# EasyEDA Pro project project.hail.fally.epro

# Schematic Schematic1
Board Name: Board1; Create Date: 2026-05-29; Page Name: P1; Project Name: Project Hail Fallyy; Schematic Name: Schematic1; Update Date: 2026-05-31; Company: EasyEDA.com; Page Size: A4; Version: V1.0
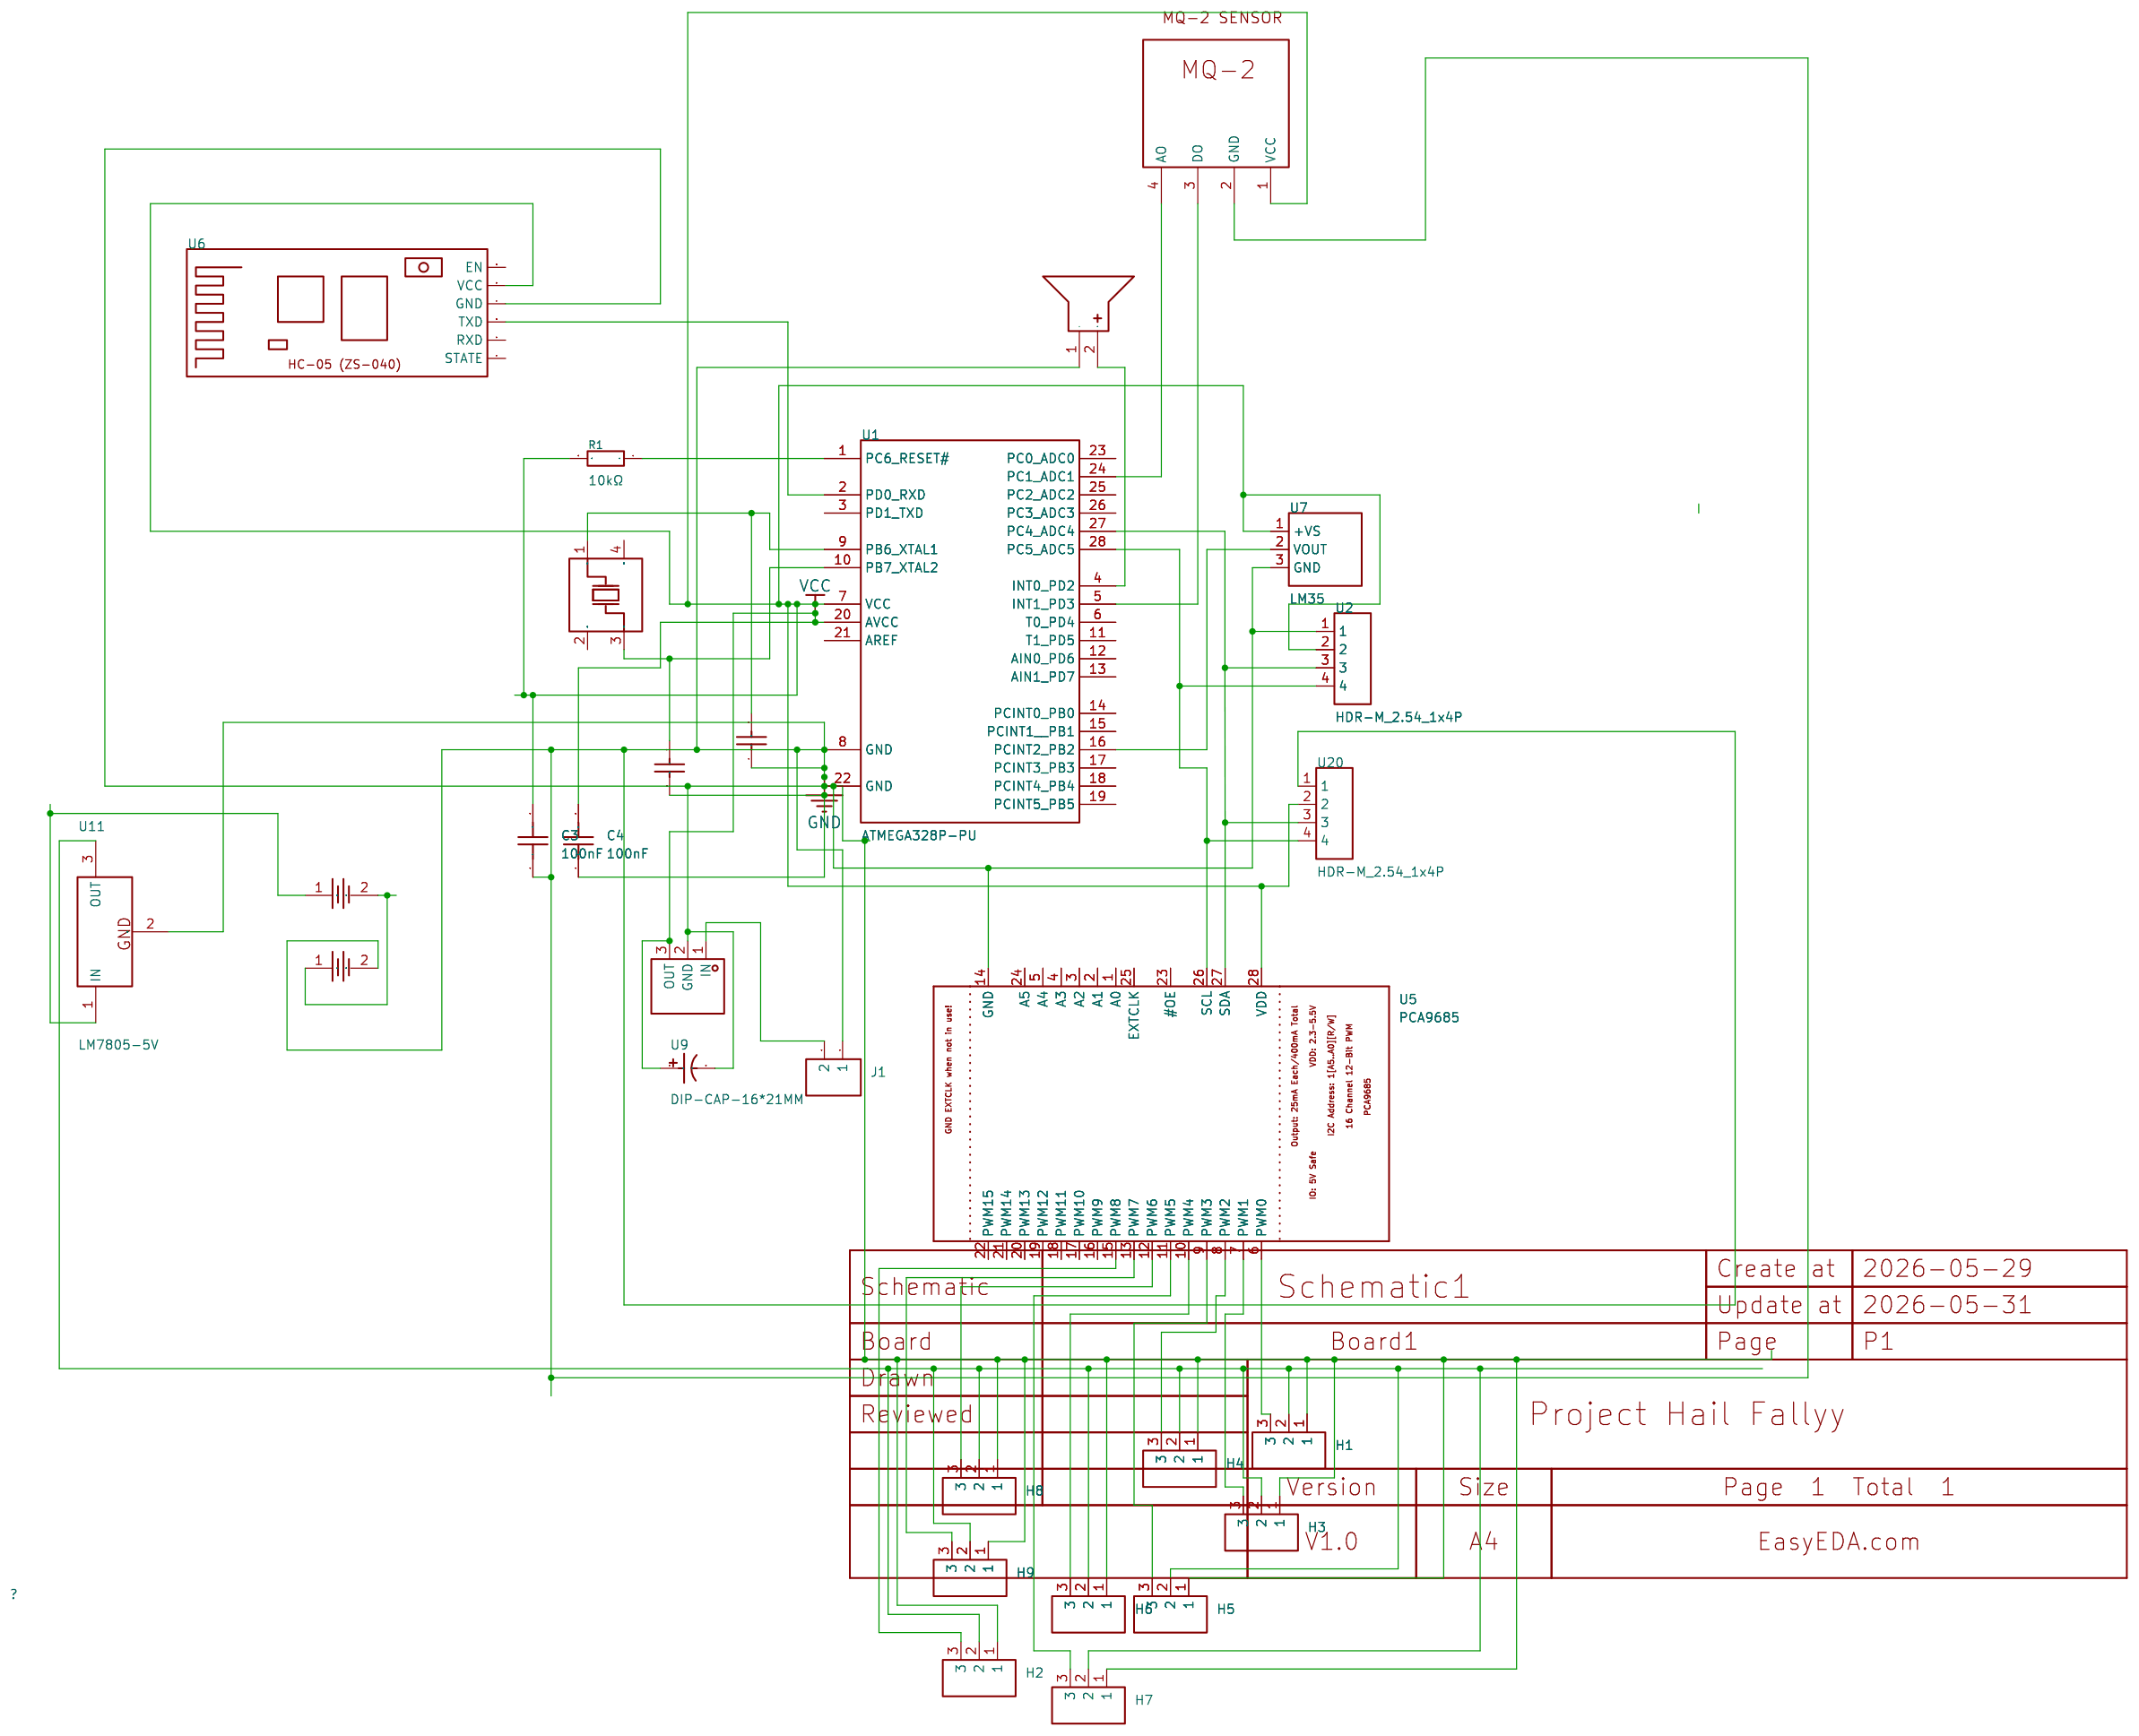
[diagram p0: schematic sheet]

## Parts
BT1  BH-18650-A5BJ001  [BAT-TH_18650-A5BJ001]
BT2  BH-18650-A5BJ001  [BAT-TH_18650-A5BJ001]
BUZZER1  buzzer  [BUZ-TH_BD12.0-P6.00-D0.9-RD]
C1  22pF  [C0805]
C2  22pF  [C0805]
C3  100nF  [C0402]
C4  100nF  [C0402]
H1  -  [HDR-TH_3P-P2.54-V-M]
H2  -  [HDR-TH_3P-P2.54-V-M]
H3  -  [HDR-TH_3P-P2.54-V-M]
H4  -  [HDR-TH_3P-P2.54-V-M]
H5  -  [HDR-TH_3P-P2.54-V-M]
H6  -  [HDR-TH_3P-P2.54-V-M]
H7  -  [HDR-TH_3P-P2.54-V-M]
H8  -  [HDR-TH_3P-P2.54-V-M]
H9  -  [HDR-TH_3P-P2.54-V-M]
J1  Bettery Connector  [HDR-M-2.54_1X2]
R1  10kΩ  [R1206]
S1  Sensor_MQ-2_module_vertical_AIH  [SENSOR_MQ-2_MODULE_VERTICAL_AIH]
U1  ATMEGA328P-PU  [DIP-28_L34.6-W7.3-P2.54-LS10.2-BL]
U2  HDR-M_2.54_1x4P  [HDR-TH_HDR-M_2.54_1X4P]
U3  LM7805  [TO-220-3_L10.0-W4.5-P2.54-L]
U5  PCA9685  [TSSOP28]
U6  HC05-Bluetooth-Module_AK  [hc05-bluetooth-module_ak]
U7  LM35  [TO-92-3_L4.8-W3.7-P1.27-L]
U9  470uF  [CAP-TH_BD13.0-P5.00-D0.6-FD]
U11  LM7805-5V  [TO-252-2_L6.6-W6.1-P4.58-LS9.9-TL]
U20  HDR-M_2.54_1x4P  [HDR-TH_HDR-M_2.54_1X4P]
X1  16MHz  [CRYSTAL-SMD_4P-L3.2-W2.5-BL]

## Library data of the parts
BT1 BT2 = BH-18650-A5BJ001: Connector Type:Battery box Battery Type:- Contact Plating:Nickel Operating Temperature Range:-25℃~+85℃ Operating Temperature Range:-25℃~+85℃; LCSC Part Name: 电池盒; Supplier Part: C5383220; Manufacturer: MYOUNG(美阳); Supplier Footprint: 插件; JLCPCB Part Class: Extended Part; Datasheet: https://atta.szlcsc.com/upload/public/pdf/source/20230321/F45C04DF2D4E00D187312CBE97BD9F67.pdf; Supplier: LCSC; Connector Type: Battery box; Contact Plating: Nickel; Operating Temperature Range: -25℃~+85℃
BUZZER1 = BUZZER: Supplier Part: C9900014030; JLCPCB Part Class: Extended Part; Supplier: LCSC
C1 C2 = CL21C220JBANNNC: Capacitance:22pF Tolerance:±5% Tolerance:±5% Voltage Rating:50V Temperature Coefficient:C0G; LCSC Part Name: 22pF ±5% 50V; Supplier Part: C1804; Manufacturer: SAMSUNG(三星); Supplier Footprint: 0805; JLCPCB Part Class: Basic Part; Datasheet: https://item.szlcsc.com/datasheet/CL21C220JBANNNC/2156.html; Supplier: LCSC; Tolerance: ±5%; Voltage Rating: 50V; Temperature Coefficient: C0G
C3 C4 = CL05B104KB54PNC: Capacitance:100nF Tolerance:±10% Tolerance:±10% Voltage Rating:50V Temperature Coefficient:X7R; LCSC Part Name: 100nF ±10% 50V; Supplier Part: C307331; Manufacturer: SAMSUNG(三星); Supplier Footprint: 0402; JLCPCB Part Class: Basic Part; Datasheet: https://item.szlcsc.com/datasheet/CL05B104KB54PNC/291005.html; Supplier: LCSC; Tolerance: ±10%; Voltage Rating: 50V; Temperature Coefficient: X7R
H1-H9 = HDR-M_2.54_1x3P: Supplier Footprint: Through
J1 = Bettery Connector
R1 = 1206W4F1002T5E: Type:Thick Film Resistor Resistance:10kΩ Tolerance:±1% Tolerance:±1% Power(Watts):250mW Voltage-Supply(Max):200V Temperature Coefficient:±100ppm/℃ Temperature Coefficient:±100ppm/℃ Operating Temperature:-55℃~+155℃ Operating Temperature:-55℃~+155℃; LCSC Part Name: 10kΩ ±1% 250mW 厚膜电阻; Supplier Part: C17902; Manufacturer: UNI-ROYAL(厚声); Supplier Footprint: 1206; JLCPCB Part Class: Basic Part; Datasheet: https://item.szlcsc.com/datasheet/1206W4F1002T5E/18590.html; Supplier: LCSC; Type: Thick Film Resistor; Tolerance: ±1%; Power(Watts): 250mW; Voltage-Supply(Max): 200V; Temperature Coefficient: ±100ppm/℃; Operating Temperature: -55℃~+155℃
S1 = MQ-2
U1 = ATMEGA328P-PU: CPU Core:AVR CPU Maximum Speed:20MHz Program Storage Size:32KB Program Memory Type:FLASH Number of I/O:23 ADC (Bit):10bit Voltage - Supply:1.8V~5.5V Voltage - Supply:1.8V~5.5V Applications:-; LCSC Part Name: MSL=1 基于AVR增强型RISC架构的低功耗CMOS 8位微控制器; Supplier Part: C33901; Manufacturer: MICROCHIP(美国微芯); Supplier Footprint: DIP-28-300mil; JLCPCB Part Class: Extended Part; Datasheet: https://item.szlcsc.com/datasheet/ATMEGA328P-PU/34869.html; Supplier: LCSC; CPU Core: AVR; CPU Maximum Speed: 20MHz; Program Storage Size: 32KB; Program Memory Type: FLASH; Number of I/O: 23; ADC (Bit): 10bit; Voltage - Supply: 1.8V~5.5V
U2 U20 = HDR-M_2.54_1x4P_C9900236824: Supplier Part: C9900236824; Supplier Footprint: HDR-TH_4P-P2.54-V-M; JLCPCB Part Class: Extended Part; Supplier: LCSC
U3 = LM7805_C845394: Output Type:Fixed Voltage - Supply:35V Output Voltage:5V Output Voltage:5V Output Current:- Power Supply Rejection Ratio (PSRR):73dB@(120Hz) Voltage Dropout:2V@(1A) standby current:5mA Noise:42uV Operating Temperature:0℃~+150℃@(Tj) Operating Temperature:0; Supplier Part: C845394; Manufacturer: TF(拓锋); Supplier Footprint: TO-220; JLCPCB Part Class: Extended Part; Datasheet: https://item.szlcsc.com/datasheet/LM7805/905247.html; Supplier: LCSC; Output Type: Fixed; Voltage - Supply: 35V; Output Voltage: 5V; Power Supply Rejection Ratio (PSRR): 73dB@(120Hz); Voltage Dropout: 2V@(1A); standby current: 5mA; Noise: 42uV; Operating Temperature: 0℃~+150℃@(Tj); Output Configuration: Positive; Number of Outputs: 1
U5 = PCA9685
U6 = HC05-Bluetooth-Module_AK: Modulo bluetooth
U7 = LM35: Detection Temperature Range:-40℃~+125℃ Detection Temperature Range:-40℃~+125℃ Tolerance:±0.5℃ Tolerance:±0.5℃ Voltage - Supply:4V~30V Voltage - Supply:4V~30V Standby Current:- Interface:- Temperature Conversion Time:- Temperature Resolution:- Operating Te; LCSC Part Name: 高精度摄氏度温度传感器; Supplier Part: C49196609; Manufacturer: Silicore(芯谷); Supplier Footprint: TO-92; JLCPCB Part Class: Extended Part; Datasheet: https://item.szlcsc.com/datasheet/LM35/51598289.html; Supplier: LCSC; Detection Temperature Range: -40℃~+125℃; Tolerance: ±0.5℃; Voltage - Supply: 4V~30V
U9 = DIP-CAP-16*21MM: Supplier Part: C9900014395; Supplier Footprint: 470UF电解电容; JLCPCB Part Class: Extended Part; Supplier: LCSC
U11 = LM7805-5V_C9900008050: Supplier Part: C9900008050; Supplier Footprint: TO-252-2; JLCPCB Part Class: Extended Part; Supplier: LCSC
X1 = X322516MLB4SI: Type:Crystal Oscillator Frequency:16MHz Normal temperature Frequency Tolerance:±10ppm Normal temperature Frequency Tolerance:±10ppm Load Capacitance:9pF Frequency Stability:±20ppm Frequency Stability:±20ppm Operating Temperature:-40℃~+85℃ Operating Temper; LCSC Part Name: YSX321SL 16MHZ 4P 3225 9PF ±10PPM -40~85℃ (±20PPM); Supplier Part: C13738; Manufacturer: YXC(扬兴晶振); Supplier Footprint: SMD3225-4P; JLCPCB Part Class: Basic Part; Datasheet: https://item.szlcsc.com/datasheet/X322516MLB4SI/14393.html; Supplier: LCSC; Type: Crystal Oscillator; Normal temperature Frequency Tolerance: ±10ppm; Load Capacitance: 9pF; Frequency Stability: ±20ppm; Operating Temperature: -40℃~+85℃

## Nets
GND: BT2.2 BUZZER1.1(-) C1.1 C2.2 C3.1 C4.1 H1.1 H2.1 H3.1 H4.1 H5.1 H6.1 H7.1 H8.1 H9.1 J1.1 S1.2(GND) U1.8(GND) U1.22(GND) U2.1 U3.2(GND) U5.14(GND) U6.4(GND) U7.3(GND) U9.2 U11.2(GND) U20.1
VCC: C3.2 C4.2 R1.2 S1.1(VCC) U1.7(VCC) U1.20(AVCC) U2.2 U3.3(OUT) U5.28(VDD) U6.5(VCC) U7.1(+VS) U9.1 U20.2
$1N555: C1.2 U1.9(PB6 XTAL1) X1.1(OSC1)
$1N611: R1.1 U1.1(PC6 RESET#)
$1N870: U1.27(PC4 ADC4) U2.3 U5.27(SDA) U20.3
$1N1628: S1.4(AO) U1.24(PC1 ADC1)
$1N1636: S1.3(DO) U1.5(INT1 PD3)
$1N1785: U1.2(PD0 RXD) U6.3(TXD)
$1N2049: BUZZER1.2(+) U1.4(INT0 PD2)
$1N5791: BT1.2 BT2.1
$1N6591: J1.2 U3.1(IN)
$1N6838: BT1.1 U11.1(IN)
$1N6843: U1.16(PCINT2 PB2) U7.2(VOUT)
$1N6867: U1.28(PC5 ADC5) U2.4 U5.26(SCL) U20.4
$1N6869: C2.1 U1.10(PB7 XTAL2) X1.3(OSC2)
$1N6886: H1.3 U5.6(PWM0)
$1N6887: H3.3 U5.7(PWM1)
$1N6888: H4.3 U5.8(PWM2)
$1N6889: H5.3 U5.9(PWM3)
$1N6890: H6.3 U5.10(PWM4)
$1N6891: H7.3 U5.11(PWM5)
$1N6892: H8.3 U5.12(PWM6)
$1N6897: H1.2 H2.2 H3.2 H4.2 H5.2 H6.2 H7.2 H8.2 H9.2 U11.3(OUT)
$1N6902: H9.3 U5.13(PWM7)
$1N6904: H2.3 U5.15(PWM8)

Not connected (* = marked no-connect by the designer): U1 3(PD1 TXD) 6(T0 PD4) 11(T1 PD5) 12(AIN0 PD6) 13(AIN1 PD7) 14(PCINT0 PB0) 15(PCINT1  PB1) 17(PCINT3 PB3) 18(PCINT4 PB4) 19(PCINT5 PB5) 21(AREF) 23(PC0 ADC0) 25(PC2 ADC2) 26(PC3 ADC3); U5 1(A0) 2(A1) 3(A2) 4(A3) 5(A4) 16(PWM9) 17(PWM10) 18(PWM11) 19(PWM12) 20(PWM13) 21(PWM14) 22(PWM15) 23(#OE) 24(A5) 25(EXTCLK); U6 1(STATE) 2(RXD) 6(EN); X1 2(GND) 4(GND)

# Board PCB1
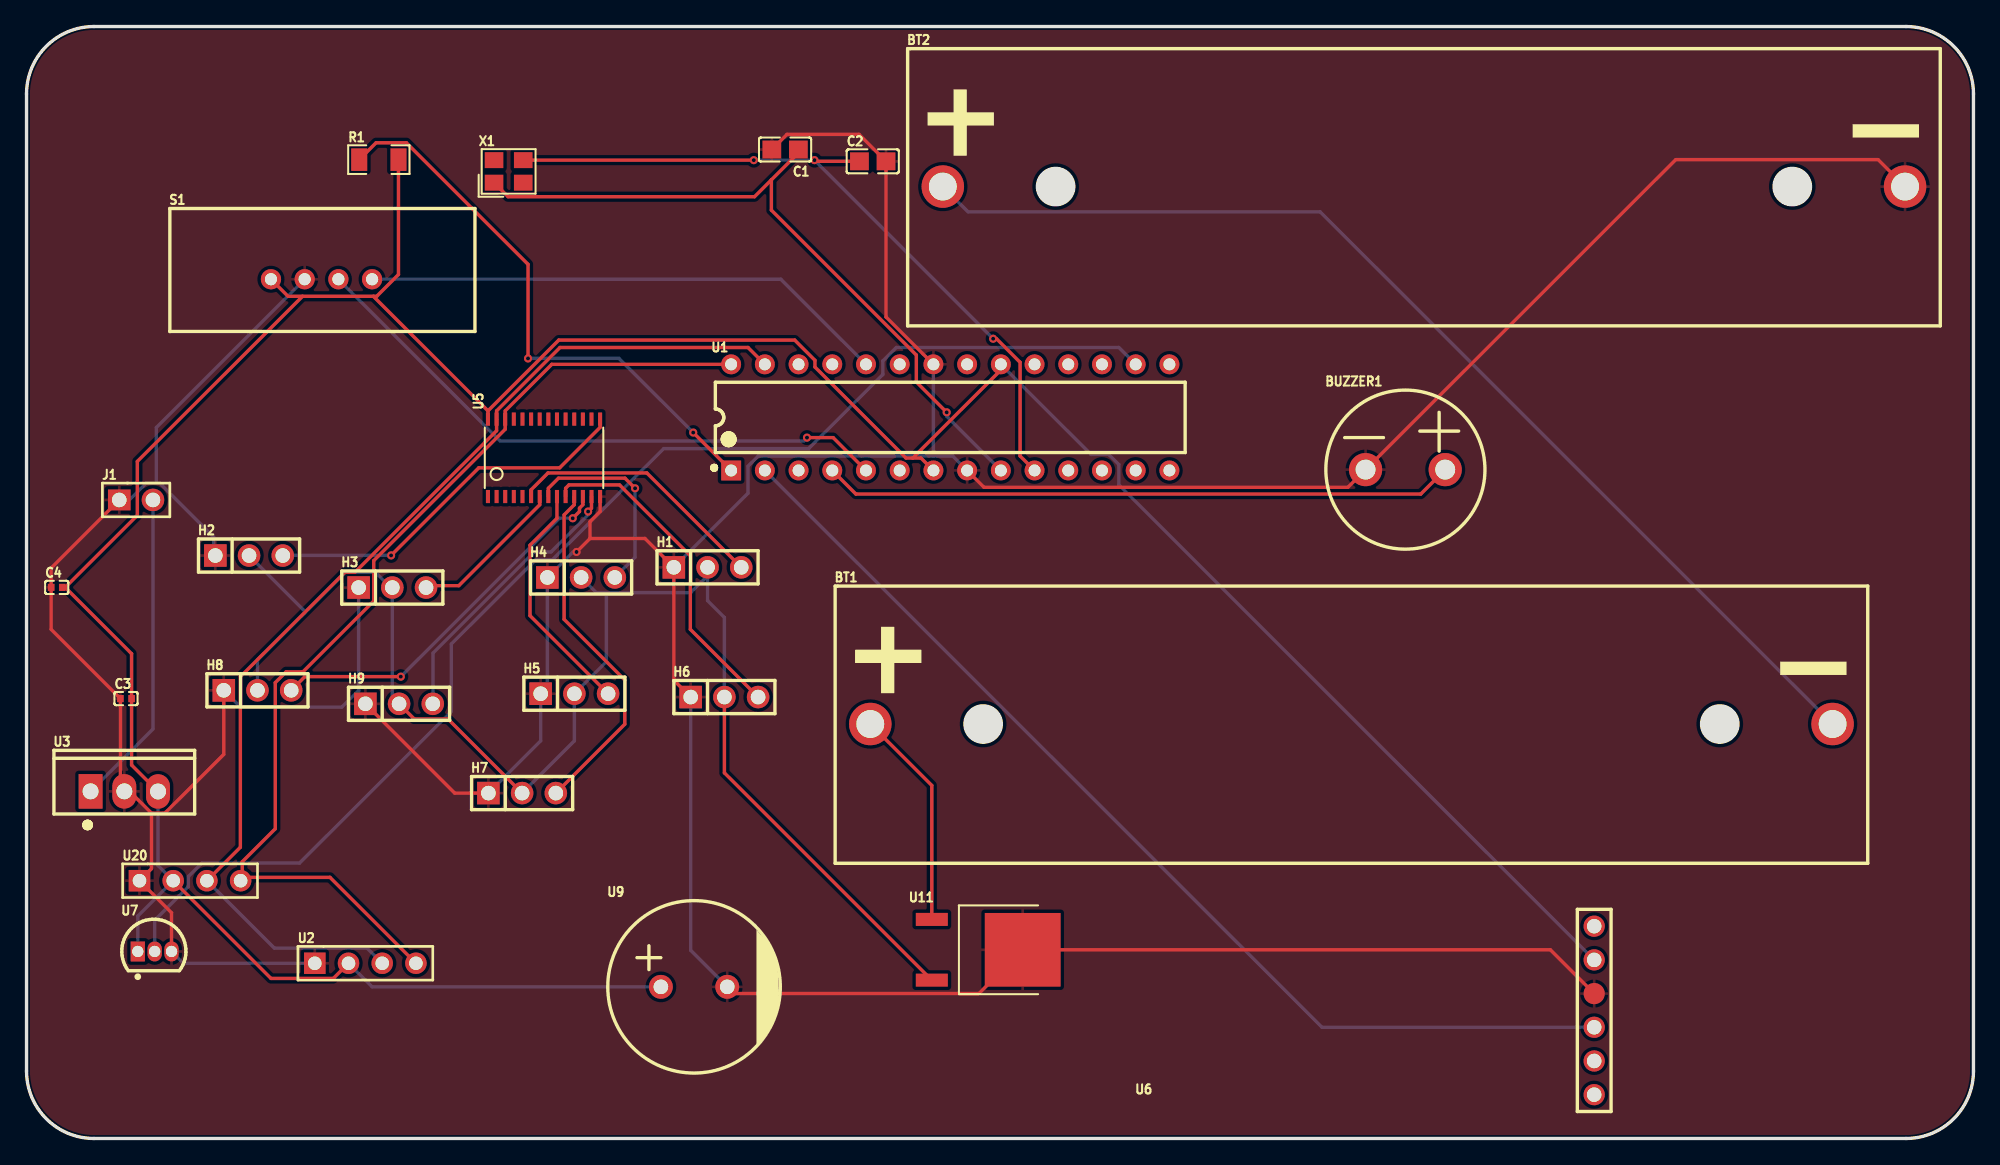
[diagram p1: board, top side]
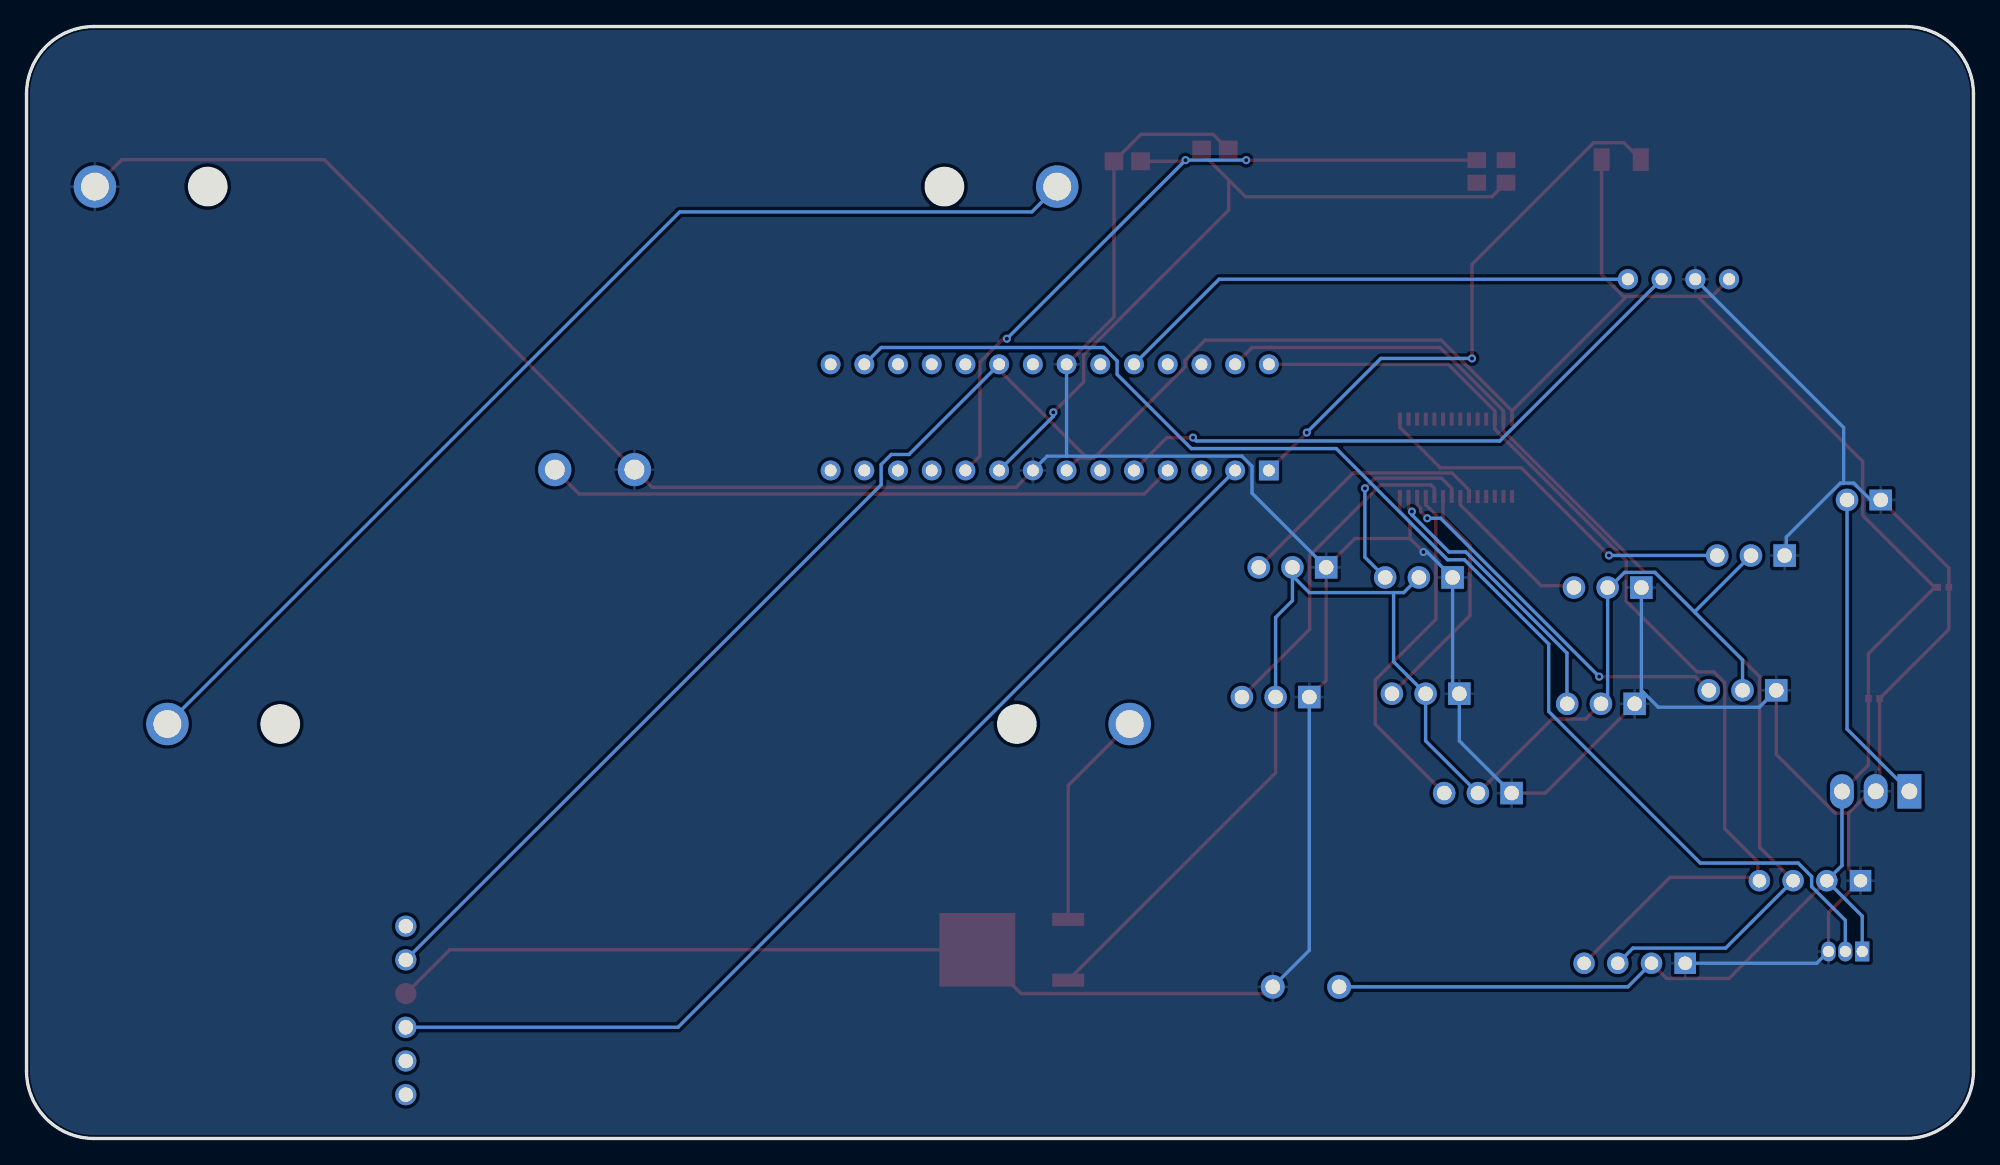
[diagram p2: board, bottom side, seen from below]

Outline 146.69 x 83.82 mm; copper layers: Top Layer, Bottom Layer. Coordinates in mm from the lower left corner of the outline.
Outline path: 0,78.74 0,5.08 arc(1.49,1.49) 5.08,0 141.6,0 arc(145.2,1.49) 146.69,5.08 146.69,78.74 arc(145.2,82.33) 141.6,83.82 5.08,83.82 arc(1.49,82.33) 0,78.74
Stack: Top Layer 0.035mm / SUBSTRATE1 1.51mm FR4 er 4.5 / Bottom Layer 0.035mm

## Design rules (mm)
spacing copperThickness1oz (default): track to track 0.102, other pairs 0.152 to 0.3
spacing copperThickness2oz: track to track 0.203, other pairs 0.152 to 0.3
spacing Plane_innerPlane: track to track 0.102, other pairs 0.152 to 0.3
spacing Copper_copperRegion: track to track 0.102, other pairs 0.152 to 0.3
track width copperThickness1oz (default): min 0.127, default 0.254, max 2.54
track width copperThickness2oz: min 0.203, default 0.254, max 2.54
differential pair differentialPair (default): width min 0.127, default 0.254, max 2.54; gap min 0.152, default 0.152
net GND uses copperRegion_copperThickness1oz
pour e416 uses Copper_copperRegion, copperRegion_Copper_copperRegion
pour e512 uses Copper_copperRegion, copperRegion_Copper_copperRegion

## Placement (name value [footprint] x y rotation side)
BT1  BH-18650-A5BJ001  [BAT-TH_18650-A5BJ001]  99.82 31.24 0 top
BT2  BH-18650-A5BJ001  [BAT-TH_18650-A5BJ001]  105.28 71.75 0 top
BUZZER1  buzzer  [BUZ-TH_BD12.0-P6.00-D0.9-RD]  103.89 50.42 0 top
C1  22pF  [C0805]  57.15 74.55 0 top
C2  22pF  [C0805]  63.75 73.66 0 top
C3  100nF  [C0402]  7.49 33.16 0 top
C4  100nF  [C0402]  2.27 41.54 0 top
H1  -  [HDR-TH_3P-P2.54-V-M]  51.31 43.05 0 top
H2  -  [HDR-TH_3P-P2.54-V-M]  16.76 43.94 0 top
H3  -  [HDR-TH_3P-P2.54-V-M]  27.56 41.53 0 top
H4  -  [HDR-TH_3P-P2.54-V-M]  41.78 42.29 0 top
H5  -  [HDR-TH_3P-P2.54-V-M]  41.27 33.53 0 top
H6  -  [HDR-TH_3P-P2.54-V-M]  52.58 33.27 0 top
H7  -  [HDR-TH_3P-P2.54-V-M]  37.34 26.03 0 top
H8  -  [HDR-TH_3P-P2.54-V-M]  17.4 33.78 0 top
H9  -  [HDR-TH_3P-P2.54-V-M]  28.07 32.77 0 top
J1  Bettery Connector  [HDR-M-2.54_1X2]  8.25 48.13 0 top
R1  10kΩ  [R1206]  26.54 73.79 0 top
S1  Sensor_MQ-2_module_vertical_AIH  [SENSOR_MQ-2_MODULE_VERTICAL_AIH]  22.22 64.77 0 top
U1  ATMEGA328P-PU  [DIP-28_L34.6-W7.3-P2.54-LS10.2-BL]  69.6 54.36 0 top
U2  HDR-M_2.54_1x4P  [HDR-TH_HDR-M_2.54_1X4P]  25.53 13.21 0 top
U3  LM7805  [TO-220-3_L10.0-W4.5-P2.54-L]  7.37 26.16 0 top
U5  PCA9685  [TSSOP28]  38.99 51.31 0 top
U6  HC05-Bluetooth-Module_AK  [hc05-bluetooth-module_ak]  118.11 16 0 top
U7  LM35  [TO-92-3_L4.8-W3.7-P1.27-L]  9.65 14.1 0 top
U9  470uF  [CAP-TH_BD13.0-P5.00-D0.6-FD]  50.29 11.43 0 top
U11  LM7805-5V  [TO-252-2_L6.6-W6.1-P4.58-LS9.9-TL]  71.63 14.22 0 top
U20  HDR-M_2.54_1x4P  [HDR-TH_HDR-M_2.54_1X4P]  12.32 19.43 0 top
X1  16MHz  [CRYSTAL-SMD_4P-L3.2-W2.5-BL]  36.32 72.9 0 top

## Footprints (pads in the part's own frame, mm; a bottom-side part is the same pattern mirrored in y, then rotated)
BAT-TH_18650-A5BJ001
  round 3.2 hole 2.1: 1(-36.25,0) 2(36.25,0)
BUZ-TH_BD12.0-P6.00-D0.9-RD
  round 2.5 hole 1.5: 1(-3,0) 2(3,0)
C0402
  rect 0.5x0.54 smd: 1(-0.42,0) 2(0.42,0)
C0805
  rect 1.41x1.35 smd: 1(-1,0) 2(1,0)
CAP-TH_BD13.0-P5.00-D0.6-FD
  round 1.8 hole 1.1: 1(-2.5,0) 2(2.5,0)
CRYSTAL-SMD_4P-L3.2-W2.5-BL
  rect 1.4x1.2 smd: 1(-1.1,-0.85) 2(1.1,-0.85) 3(1.1,0.85) 4(-1.1,0.85)
DIP-28_L34.6-W7.3-P2.54-LS10.2-BL
  rect 1.5x1.5 hole 0.9: 1(-16.51,-4)
  round 1.5 hole 0.9: 2(-13.97,-4) 3(-11.43,-4) 4(-8.89,-4) 5(-6.35,-4) 6(-3.81,-4) 7(-1.27,-4) 8(1.27,-4) 9(3.81,-4) 10(6.35,-4) 11(8.89,-4) 12(11.43,-4) 13(13.97,-4) 14(16.51,-4) 15(16.51,4) 16(13.97,4) 17(11.43,4) 18(8.89,4) 19(6.35,4) 20(3.81,4) 21(1.27,4) 22(-1.27,4) 23(-3.81,4) 24(-6.35,4) 25(-8.89,4) 26(-11.43,4) 27(-13.97,4) 28(-16.51,4)
hc05-bluetooth-module_ak
  round 1.6 hole 1.092: 1(0,-12.7) 2(0,-10.16) 3(0,-7.62) 5(0,-2.54) 6(0,0)
  round 1.6 smd: 4(0,-5.08)
HDR-M-2.54_1X2
  rect 1.7x1.575 hole 1.1: 1(-1.27,0)
  round 1.7 hole 1.1: 2(1.27,0)
HDR-TH_3P-P2.54-V-M
  rect 1.7x1.7 hole 1.1: 1(-2.54,0)
  round 1.7 hole 1.1: 2(0,0) 3(2.54,0)
HDR-TH_HDR-M_2.54_1X4P
  rect 1.62x1.62 hole 1.02: 1(-3.81,0)
  round 1.62 hole 1.02: 2(-1.27,0) 3(1.27,0) 4(3.81,0)
R1206
  rect 1.208x1.701 smd: 1(-1.479,0) 2(1.479,0)
SENSOR_MQ-2_MODULE_VERTICAL_AIH
  round 1.524 hole 0.914: 1(-3.81,0) 2(-1.27,0) 3(1.27,0) 4(3.81,0)
TO-92-3_L4.8-W3.7-P1.27-L
  rect 1.07x1.5 hole 0.85: 1(-1.27,0)
  oval 1.07x1.5 hole 0.85: 2(0,0) 3(1.27,0)
TO-220-3_L10.0-W4.5-P2.54-L
  rect 1.8x2.6 hole 1.2: 1(-2.54,0.005)
  oval 1.8x2.6 hole 1.2: 2(0,0.005) 3(2.54,-0.005)
TO-252-2_L6.6-W6.1-P4.58-LS9.9-TL
  rect 2.409x0.979 smd: 1(-3.424,2.29) 3(-3.424,-2.29)
  rect 5.711x5.548 smd: 2(3.424,0)
TSSOP28
  rect 0.305x0.991 smd: 1(-4.225,-2.918) 2(-3.575,-2.918) 3(-2.925,-2.918) 4(-2.275,-2.918) 5(-1.625,-2.918) 6(-0.975,-2.918) 7(-0.325,-2.918) 8(0.325,-2.918) 9(0.975,-2.918) 10(1.625,-2.918) 11(2.275,-2.918) 12(2.925,-2.918) 13(3.575,-2.918) 14(4.225,-2.918) 15(4.225,2.918) 16(3.575,2.918) 17(2.925,2.918) 18(2.275,2.918) 19(1.625,2.918) 20(0.975,2.918) 21(0.325,2.918) 22(-0.325,2.918) 23(-0.975,2.918) 24(-1.625,2.918) 25(-2.275,2.918) 26(-2.925,2.918) 27(-3.575,2.918) 28(-4.225,2.918)

## Nets
As in the schematic.

Pads without a net: U1 3 6 11 12 13 14 15 17 18 19 21 23 25 26; U5 1 2 3 4 5 16 17 18 19 20 21 22 23 24 25; U6 1 2 6; X1 2 4

## Via types
v1: diameter 0.61, hole 0.305, Top Layer to Bottom Layer, 13 vias

## Routing (per net, layer and track width the routed paths; a pad name or vN(x,y) marks a point on that pad's centre or on a via; arc(x,y) is an arc through that point)
GND: length 405.1
  Top Layer w0.254: 42.45,45.23 46.59,45.23 H1.1 48.77,34.54 50.04,33.27 ; 42.45,45.23 v1(41.44,44.21) ; 42.45,45.23 42.45,46.5 43.21,47.26 43.21,48.39 ; C1.1 57.29,75.69 62.72,75.69 C2.2 64.75,61.93 U1.22 ; 9.41,24.52 9.41,20.33 U20.1 10.92,17.02 10.92,14.1 ; 9.41,24.52 7.63,26.3 ; 9.41,24.52 10.43,24.52 14.86,28.96 H8.1 ; U6.4 114.81,14.22 U11.2 71.75,10.92 53.3,10.92 U9.2 ; H9.1 32.26,26.03 H7.1 ; 7.63,26.3 7.5,26.3 U3.2 ; 7.63,26.3 7.07,26.86 C3.1 1.85,38.38 C4.1 1.85,43 J1.1 ; U1.8 72.14,49.09 99.55,49.09 BUZZER1.1 124.25,73.79 139.5,73.79 BT2.2
  Bottom Layer w0.254: 50.04,33.27 50.04,14.18 U9.2 ; H2.1 14.1,44.07 14.1,45.34 10.03,49.4 9.78,49.4 ; S1.2 9.78,53.59 9.78,49.4 ; U2.1 11.81,13.21 10.92,14.1 ; 68.33,51.44 55.12,51.44 54.36,50.67 54.36,48.64 H1.1 ; 68.33,51.44 U1.22 ; 68.33,51.44 69.79,51.44 U1.8 ; 9.78,49.4 9.02,49.4 7.75,48.13 J1.1 ; 25.02,33.78 23.75,32.51 16.13,32.51 H8.1 ; 25.02,33.78 25.02,33.27 H9.1 ; 25.02,33.78 H3.1 ; v1(41.44,44.21) 41.16,44.21 H4.1 39.24,34.04 H5.1 38.73,29.97 H7.1
VCC: length 249
  Top Layer w0.254: U3.3 7.91,28.15 C3.2 7.91,36.54 2.91,41.54 ; 20.79,63.48 19.7,63.48 S1.1 ; 20.79,63.48 26.13,63.48 ; 20.79,63.48 8.35,51.04 8.35,46.97 2.91,41.54 ; U1.20 73.37,58.32 73.37,57.9 66.77,51.29 ; 26.13,63.48 26.38,63.48 28.02,65.12 R1.2 ; 26.13,63.48 34.76,54.85 ; 66.77,51.29 67.39,51.29 U1.7 ; 66.77,51.29 66.26,51.29 59.4,58.15 59.4,58.66 57.88,60.18 40.1,60.18 34.76,54.85 ; 2.91,41.54 C4.2 ; U2.2 23.11,12.06 18.41,12.06 U20.2 ; 34.76,54.85 34.76,54.23
  Bottom Layer w0.254: U3.3 9.91,20.57 U20.2 8.38,16.76 U7.1 ; 118.11,13.46 82.3,49.28 82.3,50.8 81.53,51.56 80.2,51.56 U1.20 ; U2.2 26.03,11.43 U9.1
$1N555: length 54.1
  Top Layer w0.254: v1(69.33,54.74) 67.04,57.02 67.04,59.06 56.12,69.98 56.12,72.26 ; C1.2 58.15,74.3 56.12,72.26 ; 56.12,72.26 54.85,70.99 36.28,70.99 X1.1
  Bottom Layer w0.254: U1.9 69.33,54.44 v1(69.33,54.74)
$1N611: length 42.9
  Top Layer w0.254: R1.1 26.33,75.06 28.62,75.06 37.78,65.89 v1(37.78,58.8) ; v1(50.23,53.21) U1.1
  Bottom Layer w0.254: v1(50.23,53.21) 44.64,58.8 v1(37.78,58.8)
$1N870: length 83.4
  Top Layer w0.254: U20.3 16.11,21.95 16.11,34.81 23.98,42.68 24.75,42.68 35.41,53.35 35.41,54.85 40.19,59.63 54.36,59.63 U1.27
  Bottom Layer w0.254: U2.3 25.65,14.35 18.67,14.35 U20.3
$1N1628: length 39.9
  Bottom Layer w0.254: S1.4 56.83,64.77 U1.24
$1N1636: length 45.9
  Top Layer w0.254: U1.5 60.77,52.83 v1(58.8,52.83)
  Bottom Layer w0.254: S1.3 35.69,52.58 58.55,52.58 v1(58.8,52.83)
$1N1785: length 79.9
  Bottom Layer w0.254: U6.3 97.6,8.38 U1.2
$1N2049: length 47.7
  Top Layer w0.254: BUZZER1.2 105.04,48.58 62.48,48.58 U1.4
$1N5791: length 83.8
  Bottom Layer w0.254: BT1.2 97.46,69.85 70.94,69.85 BT2.1
$1N6591: length 23.9
  Bottom Layer w0.254: J1.2 9.52,30.87 U3.1
$1N6838: length 16.6
  Top Layer w0.254: U11.1 68.2,26.61 BT1.1
$1N6843: length 98.7
  Bottom Layer w0.254: U7.2 9.65,16.45 12.19,18.99 12.19,19.75 13.21,20.76 20.57,20.76 32,32.19 32,37.27 38.35,43.62 39.62,43.62 48.01,52.01 58.93,52.01 64.52,57.59 64.52,58.61 65.53,59.63 82.3,59.63 U1.16
$1N6867: length 78.7
  Top Layer w0.254: 16.25,19.68 22.86,19.68 U2.4 ; 16.25,19.68 16.25,19.55 U20.4 ; 16.25,19.68 16.25,20.86 18.74,23.35 18.74,34.36 19.55,35.18 20.82,35.18 26.16,40.51 26.16,43.56 36.06,53.46 36.06,54.85 39.57,58.36 U1.28
$1N6869: length 55.8
  Top Layer w0.254: U1.10 74.86,51.44 74.86,58.51 73.08,60.29 v1(72.83,60.29) ; C2.1 59.45,73.66 v1(59.36,73.75) ; v1(54.79,73.75) 37.42,73.75
  Bottom Layer w0.254: v1(72.83,60.29) v1(59.36,73.75) v1(54.79,73.75)
$1N6886: length 19.8
  Top Layer w0.254: H1.3 46.73,50.17 39.28,50.17 38.01,48.9 U5.6
$1N6887: length 11.8
  Top Layer w0.254: H3.3 30.24,41.67 32.57,41.67 38.66,47.77 U5.7
$1N6888: length 15.1
  Top Layer w0.254: v1(45.85,49.01) 45.08,49.77 40.08,49.77 39.31,49.01 U5.8
  Bottom Layer w0.254: v1(45.85,49.01) 45.85,43.81 H4.3
$1N6889: length 18.1
  Top Layer w0.254: U5.9 39.96,46.75 37.93,44.72 37.93,39.41 H5.3
$1N6890: length 25.1
  Top Layer w0.254: U5.10 40.61,49.01 40.87,49.27 44.68,49.27 50.01,43.93 50.01,38.38 H6.3
$1N6891: length 26.7
  Top Layer w0.254: U5.11 41.26,47.77 40.5,47.01 40.5,39.13 45.07,34.56 45.07,31.23 H7.3
$1N6892: length 28.5
  Top Layer w0.254: U5.12 41.91,47.77 41.66,47.51 41.66,47.26 v1(41.15,46.75) ; v1(28.2,34.81) 20.97,34.81 H8.3
  Bottom Layer w0.254: v1(41.15,46.75) 40.14,46.75 v1(28.2,34.81)
$1N6897: length 109.2
  Top Layer w0.254: H6.2 52.58,27.56 U11.3 ; H7.2 31.75,31.62 29.21,31.62 H9.2
  Bottom Layer w0.254: 27.56,41.4 26.29,42.67 24,42.67 20.95,39.62 ; 27.56,41.4 27.56,33.27 H9.2 ; 27.56,41.4 H3.2 ; H8.2 17.4,36.07 20.95,39.62 ; 51.31,42.42 50.04,41.15 43.69,41.15 ; 51.31,42.42 51.31,40.54 52.58,39.27 H6.2 ; 51.31,42.42 H1.2 ; H7.2 41.27,29.97 H5.2 43.69,35.94 43.69,41.15 ; 20.95,39.62 20.95,39.75 H2.2 ; 43.69,41.15 42.93,41.15 H4.2
$1N6902: length 21.3
  Top Layer w0.254: v1(42.31,47.26) 42.56,47.51 U5.13
  Bottom Layer w0.254: v1(42.31,47.26) 42.31,47.01 39.52,44.21 38.25,44.21 30.63,36.59 30.63,32.78 H9.3
$1N6904: length 28.5
  Top Layer w0.254: v1(27.47,43.95) 34.07,50.56 40.17,50.56 43.21,53.6 43.21,54.23
  Bottom Layer w0.254: 19.3,43.94 19.31,43.95 v1(27.47,43.95)

## Copper pours and planes (outline as drawn; the poured copper is in the pictures)
GND on Top Layer: -1.52,86.11 153.54,86.11 153.54,-2.16 -1.52,-2.16
GND on Bottom Layer: -2.03,85.09 149.35,85.09 149.35,-2.16 -2.03,-2.16
